# Altium schematic sheet [16] - DOC REV HISTORY.SchDoc: DOC REVISION HISTORY
size B; Organization: Altium Limited; Address1: L3, 12a Rodborough Rd; Address2: Frenchs Forest; Address3: NSW; Address4: Australia 2086; DocumentNumber: 16; Revision: V1I1; SheetNumber: 16; SheetTotal: 16
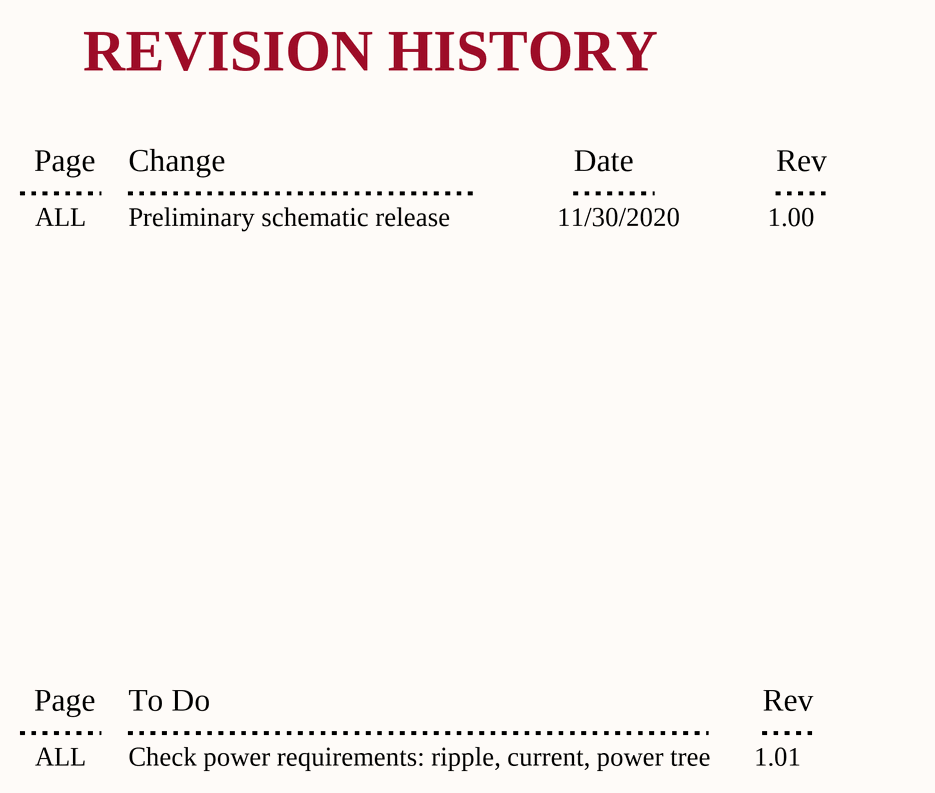
[diagram p0: [16] - DOC REV HISTORY.SchDoc]

## Notes on the sheet
- REVISION HISTORY
- Page
- Change
- Date
- Rev
- ALL
- Preliminary schematic release
- 11/30/2020
- 1.00
- To Do
- Check power requirements: ripple, current, power tree
- 1.01
- Title
- Size:
- Date:
- B
- Number:
- Time:
- Revision:
- Sheet
- of
- Mathew Locoteta
- 85 Artist Lake Dr.
- Middle Island
- New York, 11953
- United States of America
- File: